# Altium project KHNfilter.PrjPcb
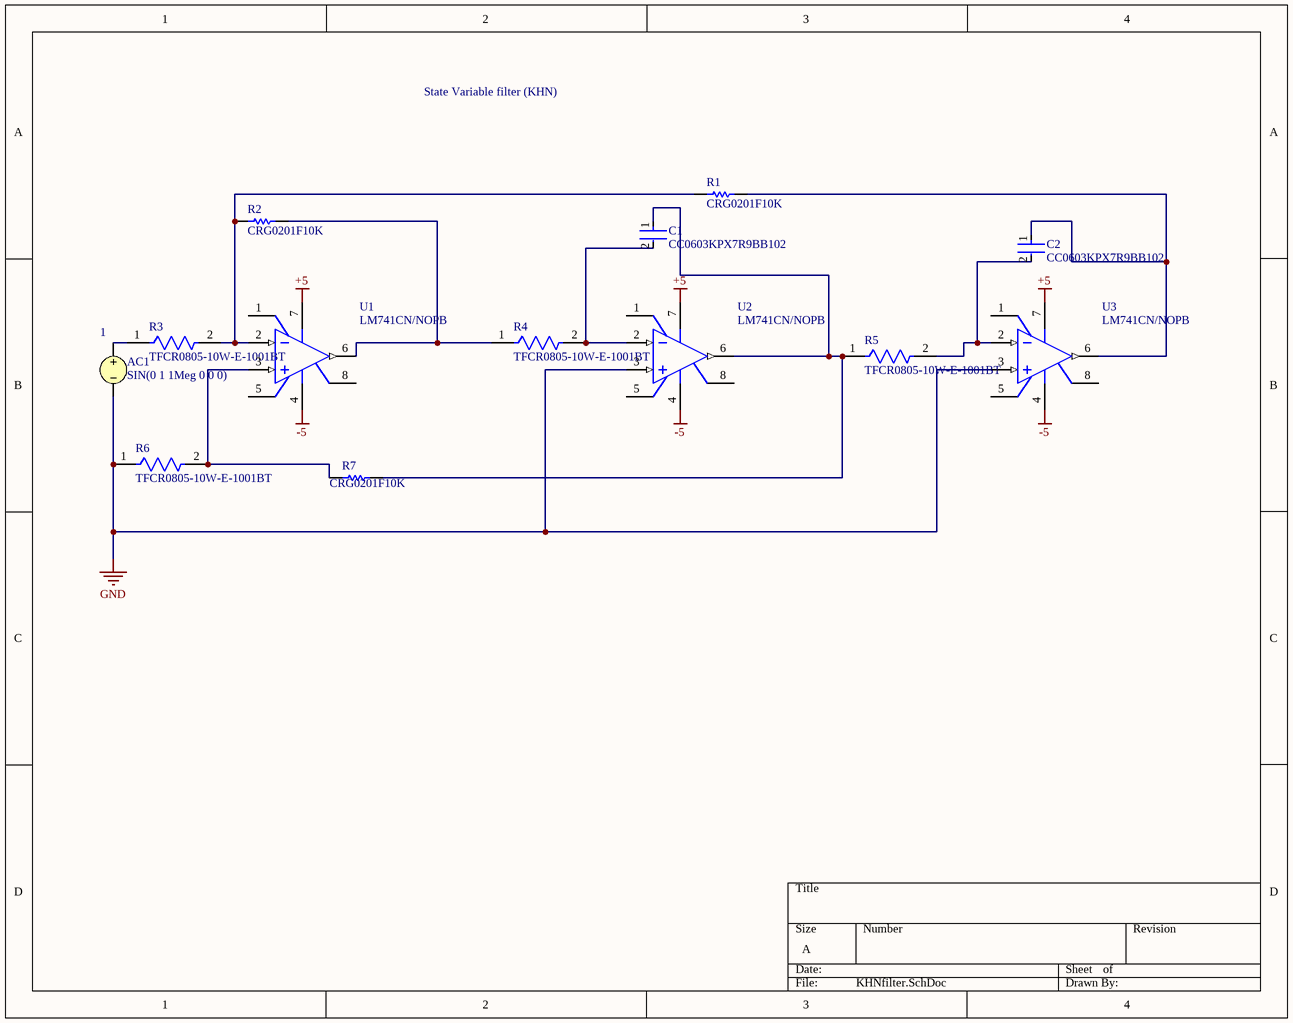
[diagram p0: KHNfilter.SchDoc]
1 sheet, 13 parts. Net scope: global (net labels, ports and power ports of the same name join across sheets).
Board file: EE333_HW4_PCBlayout.PcbDoc

## Sheet KHNfilter.SchDoc
size A; SheetNumber: 1; SheetTotal: 1

### Parts
AC1  SIN(0 1 1Meg 0 0 0)  AC Magnitude: 1
C1  CC0603KPX7R9BB102  [FP-CC0603-DA-MFG]
C2  CC0603KPX7R9BB102  [FP-CC0603-DA-MFG]
R1  CRG0201F10K  [RESC0603X26X15LL03T05]
R2  CRG0201F10K  [RESC0603X26X15LL03T05]
R3  TFCR0805-10W-E-1001BT  [FP-TFCR0805-IPC_A]
R4  TFCR0805-10W-E-1001BT  [FP-TFCR0805-IPC_A]
R5  TFCR0805-10W-E-1001BT  [FP-TFCR0805-IPC_A]
R6  TFCR0805-10W-E-1001BT  [FP-TFCR0805-IPC_A]
R7  CRG0201F10K  [RESC0603X26X15LL03T05]
U1  LM741CN/NOPB  [P0008A]
U2  LM741CN/NOPB  [P0008A]
U3  LM741CN/NOPB  [P0008A]

### Nets
+5: U1.7(V+) U2.7(V+) U3.7(V+)
-5: U1.4(V-) U2.4(V-) U3.4(V-)
GND: AC1.2 R6.1 U2.3(IN+) U3.3(IN+)
NetAC1_1: AC1.1 R3.1
NetC1_1: C1.1 R5.1 R7.2 U2.6(OUT)
NetC1_2: C1.2 R4.2 U2.2(IN-)
NetC2_1: C2.1 R1.2 U3.6(OUT)
NetC2_2: C2.2 R5.2 U3.2(IN-)
NetR1_1: R1.1 R2.1 R3.2 U1.2(IN-)
NetR2_2: R2.2 R4.1 U1.6(OUT)
NetR6_2: R6.2 R7.1 U1.3(IN+)

Not connected (* = marked no-connect by the designer): U1 1(OFS_NULL) 5(OFS_NULL) 8(NC); U2 1(OFS_NULL) 5(OFS_NULL) 8(NC); U3 1(OFS_NULL) 5(OFS_NULL) 8(NC)

### Notes on the sheet
- State Variable filter (KHN)

### Library data of the parts
AC1 = VSRC: Voltage Source; Note: PCB Footprint - Not required; AC Phase: 0; Published: 8-Jun-2000; LatestRevisionDate: 17-Jul-2002; LatestRevisionNote: Re-released for DXP Platform.; PackageReference: Not Applicable; Publisher: Altium Limited; Offset: 0; Amplitude: 1; Frequency: 1Meg; Delay: 0; Damping Factor: 0; Phase: 0
C1 C2 = CMP-03422-000958-1: CC0603 1.0 nF X7R 10.00% 50 V; Manufacturer: YAGEO; Temperature Coefficient: 15%; Voltage: 50 V; Tolerance: 0.1; Value: 1.0 nF; Material: Ceramic; Device Class L3: Ceramic Capacitors; Temperature Range Low: -55°C; Footprint Url: http://www.yageo.com/exep/pages/download/literatures/UPY-C_GEN_24.pdf; Category: Cap; RoHS: TRUE; Package: CC0603-DA; ComponentLink2URL: http://www.yageo.com/documents/recent/UPY-GPHC_X7R_6.3V-to-50V_18.pdf; Voltage Rating: 50 V; Automotive: No; Height: 0.9mm; Octopart: https://octopart.com/cc0603kpx7r9bb102-yageo-21769905; Temperature Range High: +125°C; ComponentLink2Description: Datasheet; Mouser Description: Multilayer Ceramic Capacitors MLCC - SMD/SMT 1.0nF 50V X7R 10%; Device Class L1: Passive Components; Temperature Characteristic: X7R; Temperature: -55°C to +125°C; Lead Free: Yes; Manufacturer Part Number: CC0603KPX7R9BB102; Device Class L2: Capacitors; Capacitance: 1.0 nF
R1 R2 R7 = CMP-2004-03568-1: Manufacturer: TE Connectivity / AMP; Part Number: CRG0201F10K
R3-R6 = CMP-250906-148809-1: RES Thin Film,  1kΩ, 0.1%, 0.1W, 25ppm/°C, 0805
U1-U3 = CMP-0055-00162-3: Operational Amplifier, 8-pin MDIP, Pb-Free; Manufacturer: Texas Instruments; PackageTopMarking: NSUZXYTTE#*LM*741CN; PowerWise: N; CompType: Amplifiers; ComponentLink1Description: Datasheet URL; ComponentLink1URL: http://www.ti.com/general/docs/lit/getliterature.tsp?genericPartNumber=LM741&fileType=pdf; PackageDescription: MDIP, .365 x .250 x .130in, 8 Lead, .100in Pitch; RoHS: Y; PinCount: 8; Code_JEDEC: MS-001-BA; Package Reference: P0008A